# Altium schematic sheet BANK0.SchDoc
size A4
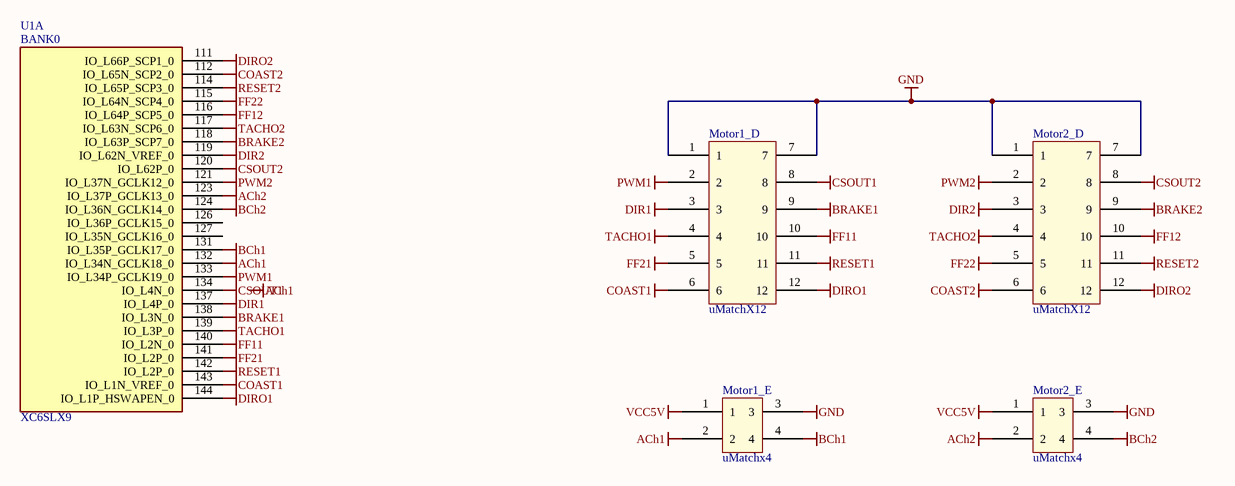
[diagram p0: BANK0.SchDoc]

## Parts
Motor1_D  uMatchX12  [uMatchX12]
Motor1_E  uMatchx4  [Micromatch x4]
Motor2_D  uMatchX12  [uMatchX12]
Motor2_E  uMatchx4  [Micromatch x4]
U1  XC6SLX9  [XC6SLX9]  (part A of 6)

## Nets
ACh1: Motor1_E.2 U1.132(IO_L34N_GCLK18_0)
ACh2: Motor2_E.2 U1.123(IO_L37P_GCLK13_0)
BCh1: Motor1_E.4 U1.131(IO_L35P_GCLK17_0)
BCh2: Motor2_E.4 U1.124(IO_L36N_GCLK14_0)
BRAKE1: Motor1_D.9 U1.138(IO_L3N_0)
BRAKE2: Motor2_D.9 U1.118(IO_L63P_SCP7_0)
COAST1: Motor1_D.6 U1.143(IO_L1N_VREF_0)
COAST2: Motor2_D.6 U1.112(IO_L65N_SCP2_0)
CSOUT1: Motor1_D.8 U1.134(IO_L4N_0)
CSOUT2: Motor2_D.8 U1.120(IO_L62P_0)
DIR1: Motor1_D.3 U1.137(IO_L4P_0)
DIR2: Motor2_D.3 U1.119(IO_L62N_VREF_0)
DIRO1: Motor1_D.12 U1.144(IO_L1P_HSWAPEN_0)
DIRO2: Motor2_D.12 U1.111(IO_L66P_SCP1_0)
FF11: Motor1_D.10 U1.140(IO_L2N_0)
FF12: Motor2_D.10 U1.116(IO_L64P_SCP5_0)
FF21: Motor1_D.5 U1.141(IO_L2P_0)
FF22: Motor2_D.5 U1.115(IO_L64N_SCP4_0)
GND: Motor1_D.1 Motor1_D.7 Motor1_E.3 Motor2_D.1 Motor2_D.7 Motor2_E.3
PWM1: Motor1_D.2 U1.133(IO_L34P_GCLK19_0)
PWM2: Motor2_D.2 U1.121(IO_L37N_GCLK12_0)
RESET1: Motor1_D.11 U1.142(IO_L2P_0)
RESET2: Motor2_D.11 U1.114(IO_L65P_SCP3_0)
TACHO1: Motor1_D.4 U1.139(IO_L3P_0)
TACHO2: Motor2_D.4 U1.117(IO_L63N_SCP6_0)
VCC5V: Motor1_E.1 Motor2_E.1

Not connected (* = marked no-connect by the designer): U1 126(IO_L36P_GCLK15_0) 127(IO_L35N_GCLK16_0)

## Notes on the sheet
- Labels drawn without touching a wire or pin: ACh1
- (in symbol C6SLX9, part A) BANK0

## Library data of the parts
U1 = C6SLX9: Imported; Farnell: http://ee.farnell.com/xilinx/xc6slx9-2tqg144c/fpga-spartan-6-lx-9k-144tqfp/dp/1876228